# EAGLE design untitled (EAGLE 9.6.2)
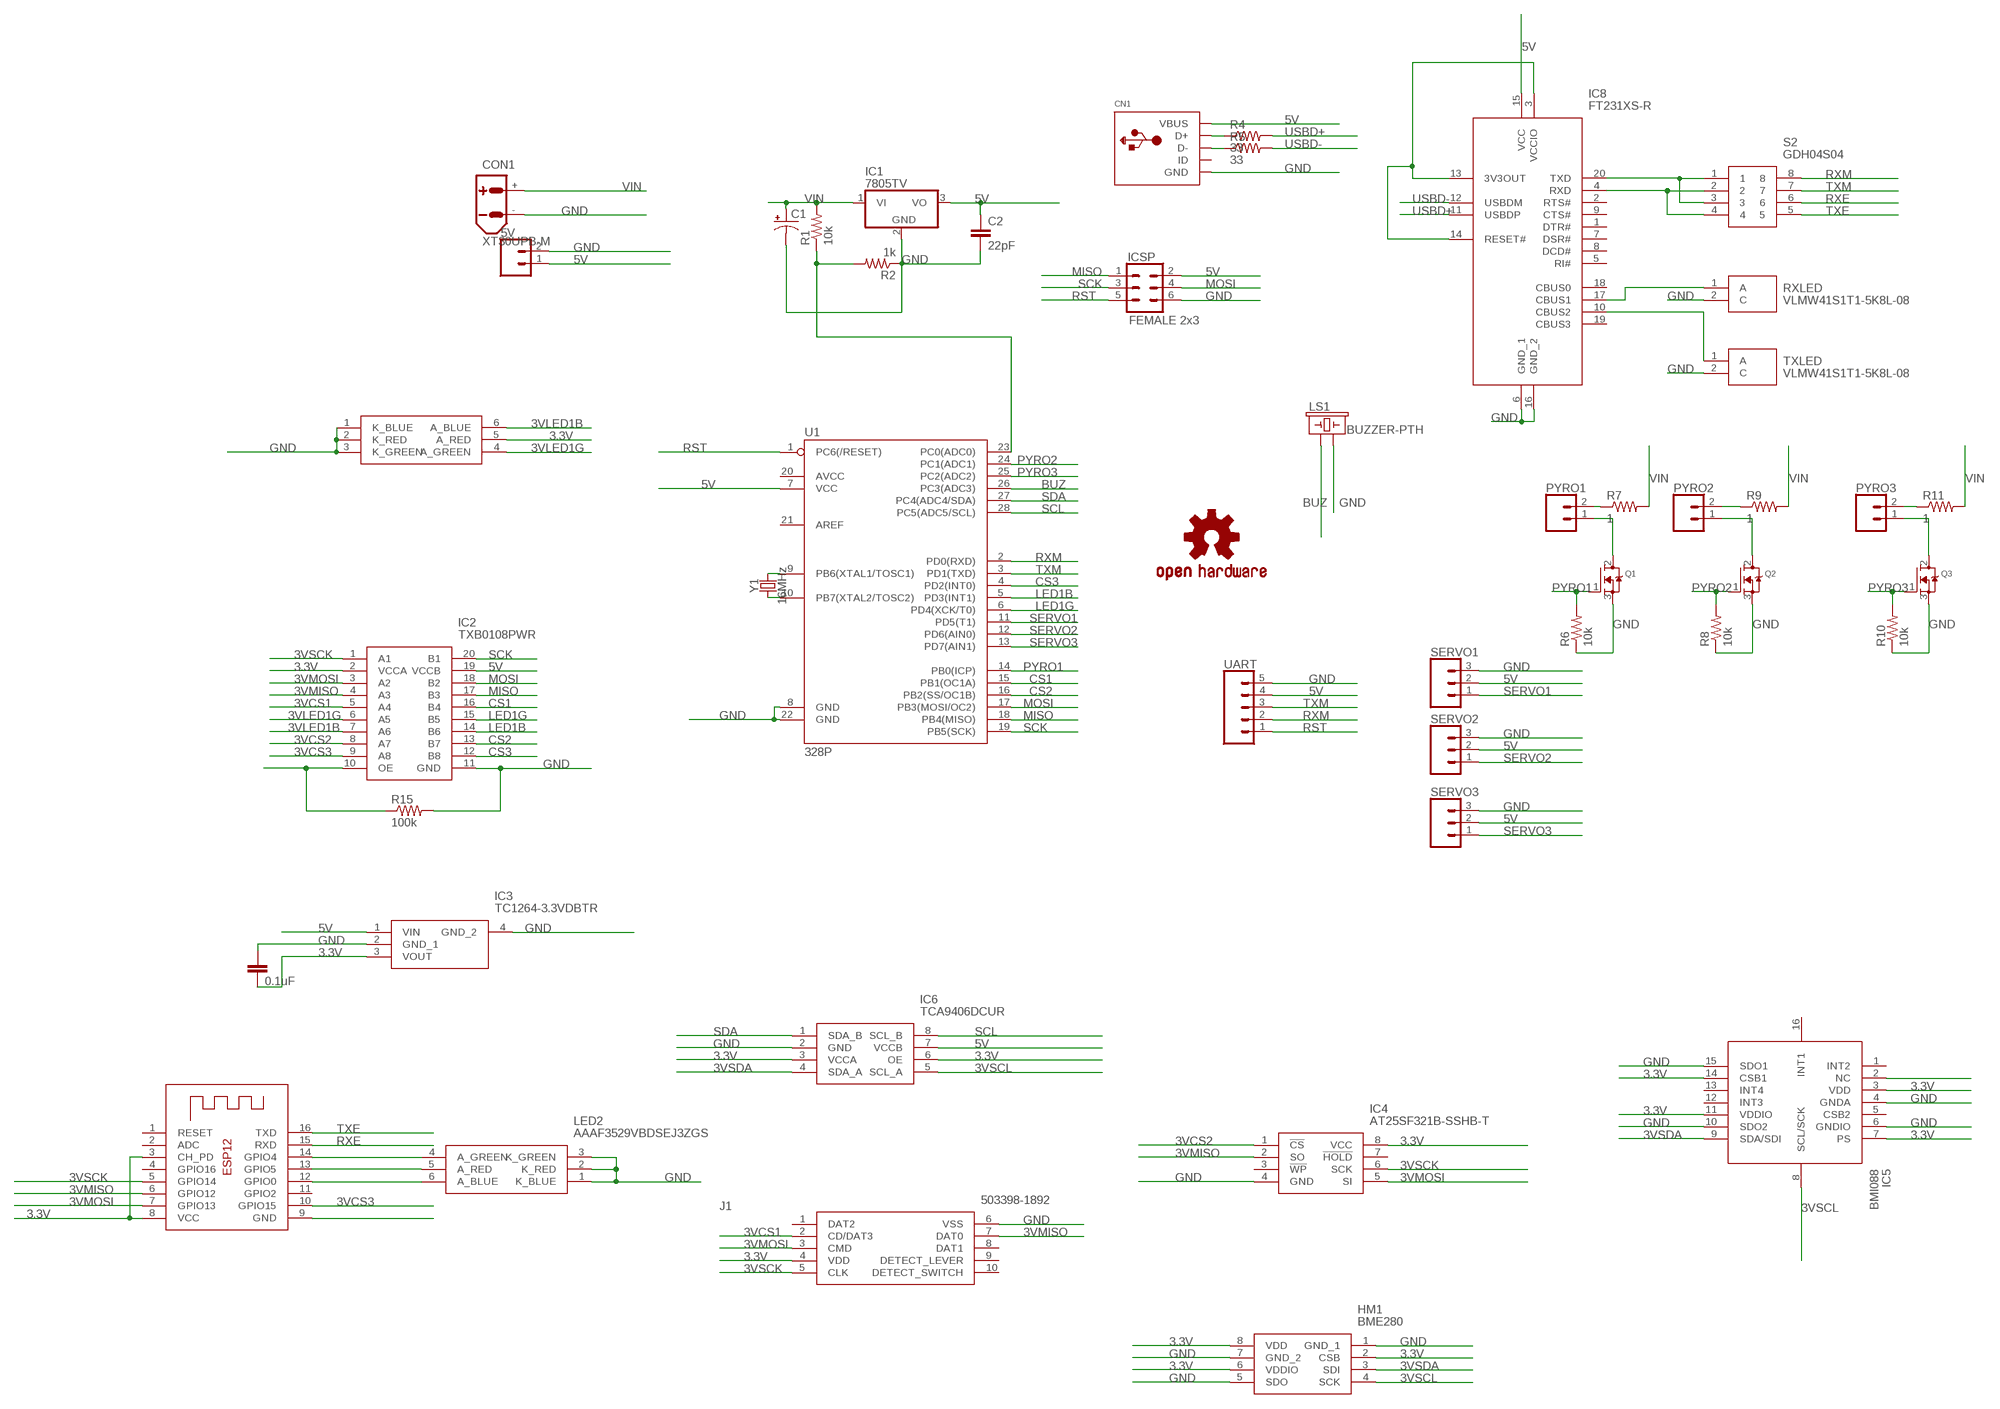
[diagram p0: schematic, sheet 1]

## Parts
5V  CONN_02  [1X02]
C1  CPOL-USE3.5-8  [E3,5-8]
C2  22pF  22PF-PTH-2.54MM-200V-5%  [CAP-PTH-2.54]
C4  0.1uF  0.1UF-KIT-EZ-50V-20%  [CAP-PTH-SMALL-KIT]
CN1  USBMINIB  [USB-MINIB]
CON1  XT30UPB-M  [XT30UPB-M]
HM1  BME280  [BME280]
IC1  7805TV  [TO220V]
IC2  TXB0108PWR  [SOP65P640X120-20N]
IC3  TC1264-3.3VDBTR  [SOT230P700X180-4N]
IC4  AT25SF321B-SSHB-T  [SOIC127P600X175-8N]
IC5  BMI088  [BMI088]
IC6  TCA9406DCUR  [SOP50P310X90-8N]
IC8  FT231XS-R  [SOP64P599X175-20N]
ICSP  FEMALE 2x3  CONN_03X2FEMALE  [2X3]
J1  503398-1892  [503398-1892]
LED1  AAAF3529VBDSEJ3ZGS  [AAAF3529VBDSEJ3ZGS]
LED2  AAAF3529VBDSEJ3ZGS  [AAAF3529VBDSEJ3ZGS]
LOGO1  OSHW-LOGOL  [OSHW-LOGO-L]
LS1  BUZZER-PTH  [BUZZER-12MM]
PYRO1  CONN_025MM  [SCREWTERMINAL-5MM-2]
PYRO2  CONN_025MM  [SCREWTERMINAL-5MM-2]
PYRO3  CONN_025MM  [SCREWTERMINAL-5MM-2]
Q1  MOSFET-NGDS_TO220V  [TO220V]
Q2  MOSFET-NGDS_TO220V  [TO220V]
Q3  MOSFET-NGDS_TO220V  [TO220V]
R1  10k  FLIPFLOP-RES  [0805-THM]
R2  1k  FLIPFLOP-RES  [0805-THM]
R4  33  FLIPFLOP-RES  [0805-THM]
R5  33  FLIPFLOP-RES  [0805-THM]
R6  10k  FLIPFLOP-RES  [0805-THM]
R7  1  FLIPFLOP-RES  [0805-THM]
R8  10k  FLIPFLOP-RES  [0805-THM]
R9  1  FLIPFLOP-RES  [0805-THM]
R10  10k  FLIPFLOP-RES  [0805-THM]
R11  1  FLIPFLOP-RES  [0805-THM]
R15  100k  FLIPFLOP-RES  [0805-THM]
RXLED  VLMW41S1T1-5K8L-08  [LEDM3528X185N]
S2  GDH04S04  [SOIC127P813X256-8N]
SERVO1  CONN_03  [1X03]
SERVO2  CONN_03  [1X03]
SERVO3  CONN_03  [1X03]
TXLED  VLMW41S1T1-5K8L-08  [LEDM3528X185N]
U1  328P  ATMEGA328P_PDIP  [DIP28]
UART  CONN_05  [1X05]
X1  ESP-12  [ESP-12]
Y1  16MHz  CRYSTAL-16MHZPTH-HC49US  [HC49US]

## Nets
3.3V: C4.2 HM1.2(CSB) HM1.6(VDDIO) HM1.8(VDD) IC2.2(VCCA) IC3.3(VOUT) IC4.8(VCC) IC5.3(VDD) IC5.7(PS) IC5.11(VDDIO) IC5.14(CSB1) IC6.3(VCCA) IC6.6(OE) J1.4(VDD) LED1.5(A_RED) X1.3(CH_PD) X1.8(VCC)
3VCS1: IC2.5(A4) J1.2(CD/DAT3)
3VCS2: IC2.8(A7) IC4.1(!CS)
3VCS3: IC2.9(A8) X1.10(GPIO15)
3VLED1B: IC2.7(A6) LED1.6(A_BLUE)
3VLED1G: IC2.6(A5) LED1.4(A_GREEN)
3VMISO: IC2.4(A3) IC4.2(SO) J1.7(DAT0) X1.6(GPIO12)
3VMOSI: IC2.3(A2) IC4.5(SI) J1.3(CMD) X1.7(GPIO13)
3VSCK: IC2.1(A1) IC4.6(SCK) J1.5(CLK) X1.5(GPIO14)
3VSCL: HM1.4(SCK) IC5.8(SCL/SCK) IC6.5(SCL_A)
3VSDA: HM1.3(SDI) IC5.9(SDA/SDI) IC6.4(SDA_A)
5V: 5V.1 C2.1 CN1.VBUS IC1.3(VO) IC2.19(VCCB) IC3.1(VIN) IC6.7(VCCB) IC8.15(VCC) ICSP.2 SERVO1.2 SERVO2.2 SERVO3.2 U1.7(VCC) UART.4
BUZ: LS1.+ U1.26(PC3(ADC3))
CS1: IC2.16(B4) U1.15(PB1(OC1A))
CS2: IC2.13(B7) U1.16(PB2(SS/OC1B))
CS3: IC2.12(B8) U1.4(PD2(INT0))
GND: 5V.2 C1.- C2.2 C4.1 CN1.GND CON1.- HM1.1(GND_1) HM1.5(SDO) HM1.7(GND_2) IC1.2(GND) IC2.11(GND) IC3.2(GND_1) IC3.4(GND_2) IC4.4(GND) IC5.4(GNDA) IC5.6(GNDIO) IC5.10(SDO2) IC5.15(SDO1) IC6.2(GND) IC8.6(GND_1) IC8.16(GND_2) ICSP.6 J1.6(VSS) LED1.1(K_BLUE) LED1.2(K_RED) LED1.3(K_GREEN) LED2.1(K_BLUE) LED2.2(K_RED) LED2.3(K_GREEN) LS1.- Q1.3(S) Q2.3(S) Q3.3(S) R2.1 R6.1 R8.1 R10.1 R15.2 RXLED.2(C) SERVO1.3 SERVO2.3 SERVO3.3 TXLED.2(C) U1.8(GND) U1.22(GND) UART.5 X1.9(GND)
LED1B: IC2.14(B6) U1.5(PD3(INT1))
LED1G: IC2.15(B5) U1.6(PD4(XCK/T0))
MISO: IC2.17(B3) ICSP.1 U1.18(PB4(MISO))
MOSI: IC2.18(B2) ICSP.4 U1.17(PB3(MOSI/OC2))
N$1: U1.9(PB6(XTAL1/TOSC1)) Y1.2
N$2: U1.10(PB7(XTAL2/TOSC2)) Y1.1
N$3: R1.1 R2.2 U1.23(PC0(ADC0))
N$4: CN1.D+ R4.1
N$5: IC8.17(CBUS1) RXLED.1(A)
N$6: IC8.20(TXD) S2.1 S2.3
N$7: IC8.4(RXD) S2.2 S2.4
N$8: IC8.3(VCCIO) IC8.13(3V3OUT) IC8.14(RESET#)
N$10: CN1.D- R5.1
N$11: IC8.10(CBUS2) TXLED.1(A)
N$12: LED2.4(A_GREEN) X1.14(GPIO4)
N$13: LED2.5(A_RED) X1.13(GPIO5)
N$14: IC2.10(OE) R15.1
N$15: PYRO1.1 Q1.2(D)
N$16: PYRO1.2 R7.1
N$17: PYRO2.1 Q2.2(D)
N$18: PYRO2.2 R9.1
N$19: PYRO3.1 Q3.2(D)
N$20: PYRO3.2 R11.1
N$21: LED2.6(A_BLUE) X1.12(GPIO0)
N$24: IC5.2(NC)
PYRO1: Q1.1(G) R6.2 U1.14(PB0(ICP))
PYRO2: Q2.1(G) R8.2 U1.24(PC1(ADC1))
PYRO3: Q3.1(G) R10.2 U1.25(PC2(ADC2))
RST: ICSP.5 U1.1(PC6(/RESET)) UART.1
RXE: S2.6 X1.15(RXD)
RXM: S2.8 U1.2(PD0(RXD)) UART.2
SCK: IC2.20(B1) ICSP.3 U1.19(PB5(SCK))
SCL: IC6.8(SCL_B) U1.28(PC5(ADC5/SCL))
SDA: IC6.1(SDA_B) U1.27(PC4(ADC4/SDA))
SERVO1: SERVO1.1 U1.11(PD5(T1))
SERVO2: SERVO2.1 U1.12(PD6(AIN0))
SERVO3: SERVO3.1 U1.13(PD7(AIN1))
TXE: S2.5 X1.16(TXD)
TXM: S2.7 U1.3(PD1(TXD)) UART.3
USBD+: IC8.11(USBDP) R4.2
USBD-: IC8.12(USBDM) R5.2
VIN: C1.+ CON1.+ IC1.1(VI) R1.2 R7.2 R9.2 R11.2
Unconnected: CN1.ID IC4.3(!WP) IC4.7(!HOLD) IC5.1(INT2) IC5.5(CSB2) IC5.12(INT3) IC5.13(INT4) IC5.16(INT1) IC8.1(DTR#) IC8.2(RTS#) IC8.5(RI#) IC8.7(DSR#) IC8.8(DCD#) IC8.9(CTS#) IC8.18(CBUS0) IC8.19(CBUS3) J1.1(DAT2) J1.8(DAT1) J1.9(DETECT_LEVER) J1.10(DETECT_SWITCH) U1.20(AVCC) U1.21(AREF) X1.1(RESET) X1.2(ADC) X1.4(GPIO16) X1.11(GPIO2)

## Library data of the parts
5V = SparkFun-Connectors:CONN_02: Multi connection point. Often used as Generic Header-pin footprint for 0.1 inch spaced/style header connections On any of the 0.1 inch spaced packages, you can populate with these: Break Away Headers - Straight <https://www.sparkfun.com/products/116> (PRT-00116) Break Away Male Headers - Right Angle <https://www.sparkfun.com/products/553> (PRT-00553) Female Headers <https://www.sparkfun.com/products/115> (PRT-00115) Break Away Headers - Machine Pin <https://www.sparkfun.com/products/117> (PRT-00117) Break Away Female Headers - Swiss Machine Pin <https://www.sparkfun.com/products/743> (PRT-00743) For SCREWTERMINALS and SPRING TERMINALS visit here: Screw Terimnals on SparkFun.com <https://www.sparkfun.com/search/results?term=Screw+Terminals> (5mm/3.5mm/2.54mm spacing) This device is also useful as a general connection point to wire up your design to another part of your project. Our various solder wires solder well into these plated through hole pads. Hook-Up Wire - Assortment (Stranded, 22 AWG) <https://www.sparkfun.com/products/11375> (PRT-11375) Hook-Up Wire - Assortment (Solid Core, 22 AWG) <https://www.sparkfun.com/products/11367> (PRT-11367) View the entire wire category on our website here <https://www.sparkfun.com/categories/141> Special notes: Molex polarized connector foot print use with: PRT-08233 with associated crimp pins and housings. 2.54_SCREWTERM for use with PRT-10571. 3.5mm Screw Terminal footprints for PRT-08084 5mm Screw Terminal footprints for use with PRT-08432
C1 = rcl:CPOL-US: POLARIZED CAPACITOR, American symbol; SPICEPREFIX: C
C2 = SparkFun-Capacitors:22PF: 22pF ceramic capacitors A capacitor is a passive two-terminal electrical component used to store electrical energy temporarily in an electric field.; PROD_ID: CAP-09128
C4 = SparkFun-Capacitors:0.1UF: 0.1µF ceramic capacitors A capacitor is a passive two-terminal electrical component used to store electrical energy temporarily in an electric field.; PROD_ID: CAP-08370
CN1 = adafruit:USB: USB Connectors USBMINIB - Surface Mount Female Mini-B USB Connector 4UConnector: 06564 By microbuilder.eu Thru-hole RA Female Mini-B USB Connector 4UConnector: 18732 By ladyada.net
CON1 = amass:XT30: AMASS XT30 connector Store in Japan AMASS XT30 connector <https://szc.jp/ams-xt30>
HM1 = BME280:BME280: Board Mount Humidity Sensors Source: Datasheet <https://datasheet.datasheetarchive.com/originals/distributors/DKDS-24/462906.pdf>; DESCRIPTION: Board Mount Humidity Sensors; HEIGHT: mm; MANUFACTURER_NAME: BOSCH; MANUFACTURER_PART_NUMBER: BME280; MOUSER_PART_NUMBER: 262-BME280; MOUSER_PRICE-STOCK: https://www.mouser.co.uk/ProductDetail/Bosch-Sensortec/BME280?qs=2OnyuXx6vpj2fK9HX7qb3g%3D%3D
IC1 = linear:78*: Positive VOLTAGE REGULATOR Source: http://cache.national.com/ds/LM/LM78L05.pdf http://www.fairchildsemi.com/ds/LM/LM7805.pdf
IC2 = TXB0108PWR:TXB0108PWR: 8-Bit Bidirectional Voltage-Level Shifter with Auto Direction Sensing and +/-15-kV ESD Protect Source: Datasheet <http://www.ti.com/lit/ds/symlink/txb0108.pdf>; DESCRIPTION: 8-Bit Bidirectional Voltage-Level Shifter with Auto Direction Sensing and +/-15-kV ESD Protect; HEIGHT: 1.2mm; MANUFACTURER_NAME: Texas Instruments; MANUFACTURER_PART_NUMBER: TXB0108PWR; MOUSER_PART_NUMBER: 595-TXB0108PWR; MOUSER_PRICE-STOCK: https://www.mouser.co.uk/ProductDetail/Texas-Instruments/TXB0108PWR?qs=oFXvjAmG9EgEUWGWzOVFCA%3D%3D
IC3 = TC1264-3.3VDBTR:TC1264-3.3VDBTR: LDO Voltage Regulators 800mA Fixed Output Source: Datasheet; DESCRIPTION: LDO Voltage Regulators 800mA Fixed Output; HEIGHT: 1.8mm; MANUFACTURER_NAME: Microchip; MANUFACTURER_PART_NUMBER: TC1264-3.3VDBTR; MOUSER_PART_NUMBER: 579-TC1264-3.3VDBTR; MOUSER_PRICE-STOCK: https://www.mouser.co.uk/ProductDetail/Microchip-Technology-Atmel/TC1264-3.3VDBTR?qs=EkZBwCRGcSs72PT5fOeaFg%3D%3D
IC4 = AT25SF321B-SSHB-T:AT25SF321B-SSHB-T: NOR Flash 32 Mbit, 3.0V (2.7V to 3.6V), -40C to 85C, SOIC-N 150mil (Tape & Reel), Single, Dual, Quad SPI NOR flash Source: Datasheet <https://www.mouser.fr/datasheet/2/698/adet_s_a0010543939_1-2956529.pdf>; DESCRIPTION: NOR Flash 32 Mbit, 3.0V (2.7V to 3.6V), -40C to 85C, SOIC-N 150mil (Tape & Reel), Single, Dual, Quad SPI NOR flash; HEIGHT: 1.75mm; MANUFACTURER_NAME: Dialog Semiconductor; MANUFACTURER_PART_NUMBER: AT25SF321B-SSHB-T; MOUSER_PART_NUMBER: 988-AT25SF321BSSHB-T; MOUSER_PRICE-STOCK: https://www.mouser.co.uk/ProductDetail/Dialog-Semiconductor/AT25SF321B-SSHB-T?qs=IS%252B4QmGtzzpJt7diTvTTCw%3D%3D
IC5 = BMI088:BMI088: Inertial Measurement Unit Digital Output 2.5V/3.3V Automotive Source: Datasheet <https://datasheet.datasheetarchive.com/originals/distributors/Datasheets_SAMA/994c3bf88e91a9e9fead6a819d348e4d.pdf>; DESCRIPTION: Inertial Measurement Unit Digital Output 2.5V/3.3V Automotive; HEIGHT: 1.45mm; MANUFACTURER_NAME: BOSCH; MANUFACTURER_PART_NUMBER: BMI088; MOUSER_PART_NUMBER: 262-BMI088; MOUSER_PRICE-STOCK: https://www.mouser.co.uk/ProductDetail/Bosch-Sensortec/BMI088?qs=f9yNj16SXrIMFspTV6RB6Q%3D%3D
IC6 = TCA9406DCUR:TCA9406DCUR: 2-Bit Bidirectional 1-MHz I2C Bus and SMBus Voltage-Level Shifter Source: Datasheet <http://www.ti.com/lit/ds/symlink/tca9406.pdf>; DESCRIPTION: 2-Bit Bidirectional 1-MHz I2C Bus and SMBus Voltage-Level Shifter; HEIGHT: 0.9mm; MANUFACTURER_NAME: Texas Instruments; MANUFACTURER_PART_NUMBER: TCA9406DCUR; MOUSER_PART_NUMBER: 595-TCA9406DCUR; MOUSER_PRICE-STOCK: https://www.mouser.co.uk/ProductDetail/Texas-Instruments/TCA9406DCUR?qs=Ze4%2FuFuz19JoG7CJtrwdKQ%3D%3D
IC8 = FT231XS-R:FT231XS-R: FTDI Chip FT231XS-R, Interface RS232, RS422, RS485, SIE, UART 3MBd, 5 V, 20-pin, SSOP Source: Datasheet <https://datasheet.datasheetarchive.com/originals/distributors/Datasheets_SAMA/824938d1687833d6997706543241551a.pdf>; DESCRIPTION: FTDI Chip FT231XS-R, Interface RS232, RS422, RS485, SIE, UART 3MBd, 5 V, 20-pin, SSOP; HEIGHT: 1.753mm; MANUFACTURER_NAME: FTDI Chip; MANUFACTURER_PART_NUMBER: FT231XS-R; MOUSER_PART_NUMBER: 895-FT231XS-R; MOUSER_PRICE-STOCK: https://www.mouser.co.uk/ProductDetail/FTDI/FT231XS-R?qs=Gp1Yz1mis3WduRPsgrTbtg%3D%3D
ICSP = SparkFun-Connectors:CONN_03X2: Multi connection point. Often used as Generic Header-pin footprint for 0.1 inch spaced/style header connections You can populate with any combo of single row headers, but if you'd like an exact match, check these: Header - 2x3 (Male, 0.1") <https://www.sparkfun.com/products/12807> (PRT-12807) Header - 2x3 (Female, 0.1") <https://www.sparkfun.com/products/13010> (PRT-13010) 2x3 Pin Shrouded Header <https://www.sparkfun.com/products/10877> (PRT-10877) On any of the 0.1 inch spaced packages, you can populate with these: Break Away Headers - Straight <https://www.sparkfun.com/products/116> (PRT-00116) Break Away Male Headers - Right Angle <https://www.sparkfun.com/products/553> (PRT-00553) Female Headers <https://www.sparkfun.com/products/115> (PRT-00115) Break Away Headers - Machine Pin <https://www.sparkfun.com/products/117> (PRT-00117) Break Away Female Headers - Swiss Machine Pin <https://www.sparkfun.com/products/743> (PRT-00743) Special note: the shrouded connector mates well with our 3x2 ribbon cables: Ribbon Crimp Connector - 6-pin (2x3, Female) <https://www.sparkfun.com/products/10651> (PRT-10651) Ribbon Cable - 6 wire (15ft) <https://www.sparkfun.com/products/10646> (PRT-10646); PROD_ID: CONN-11566
J1 = 503398-1892:503398-1892: MicroSD SMT Push-Push 1.28mm height MicroSD SMT Push-Push 1.28mm height Source: Datasheet <http://www.molex.com/webdocs/datasheets/pdf/en-us//5033981892_MEMORY_CARD_SOCKET.pdf>; DESCRIPTION: MicroSD SMT Push-Push 1.28mm height MicroSD SMT Push-Push 1.28mm height; HEIGHT: mm; MANUFACTURER_NAME: Molex; MANUFACTURER_PART_NUMBER: 503398-1892; MOUSER_PART_NUMBER: 538-503398-1892; MOUSER_PRICE-STOCK: https://www.mouser.co.uk/ProductDetail/Molex/503398-1892?qs=b0v8CoHHvSMxV%252BW12iKaSg%3D%3D
LED1 LED2 = AAAF3529VBDSEJ3ZGS:AAAF3529VBDSEJ3ZGS: Standard LEDs - SMD 3.5X2.8MM RGB SMD LED Source: Datasheet <https://componentsearchengine.com/Datasheets/1/AAAF3529VBDSEJ3ZGS.pdf>; DESCRIPTION: Standard LEDs - SMD 3.5X2.8MM RGB SMD LED; HEIGHT: 1.85mm; MANUFACTURER_NAME: Kingbright; MANUFACTURER_PART_NUMBER: AAAF3529VBDSEJ3ZGS; MOUSER_PART_NUMBER: 604-AAAF3529VBDSEJ3Z; MOUSER_PRICE-STOCK: https://www.mouser.com/Search/Refine.aspx?Keyword=604-AAAF3529VBDSEJ3Z
LOGO1 = SparkFun-Aesthetics:OSHW-LOGO: Open-Source Hardware (OSHW) Logo This logo indicates the piece of hardware it is found on incorporates a OSHW license and/or adheres to the definition of open source hardware found here: http://freedomdefined.org/OSHW
LS1 = SparkFun-Electromechanical:BUZZER: Buzzer Small round buzzers that operate around the audible 2kHz range. You can use these as speakers to create simple music or user interfaces. Variant Overview: PTH - Mini Speaker - PC Mount 12mm 2.048kHz <https://www.sparkfun.com/products/7950> PTH_KIT - Mini Speaker - PC Mount 12mm 2.048kHz <https://www.sparkfun.com/products/7950> KIT simplifies soldering by adding stop mask to one side of the pads. PTH_NO_SILK - Mini Speaker - PC Mount 12mm 2.048kHz <https://www.sparkfun.com/products/7950> No silkscreen indicator of buzzer outline. PTH_KIT_NO_SILK - Mini Speaker - PC Mount 12mm 2.048kHz <https://www.sparkfun.com/products/7950> KIT package w/o silkscreen SMD - Buzzer Audio Magnetic (CCV-084B16) SMD buzzer used on, e.g. the LilyPad Buzzer <https://www.sparkfun.com/products/8463> and RFID USB Reader <https://www.sparkfun.com/products/9963>. SMD_KIT - Buzzer Audio Magnetic (CCV-084B16) SMD Buzzer with elongated pins to make soldering easier. Used on the SparkFun Simon Says - Surface Mount Soldering Kit <https://www.sparkfun.com/products/10935>.; PROD_ID: COMP-08253; SF_SKU: COM-07950
PYRO1-PYRO3 = SparkFun-Connectors:CONN_02: Multi connection point. Often used as Generic Header-pin footprint for 0.1 inch spaced/style header connections On any of the 0.1 inch spaced packages, you can populate with these: Break Away Headers - Straight <https://www.sparkfun.com/products/116> (PRT-00116) Break Away Male Headers - Right Angle <https://www.sparkfun.com/products/553> (PRT-00553) Female Headers <https://www.sparkfun.com/products/115> (PRT-00115) Break Away Headers - Machine Pin <https://www.sparkfun.com/products/117> (PRT-00117) Break Away Female Headers - Swiss Machine Pin <https://www.sparkfun.com/products/743> (PRT-00743) For SCREWTERMINALS and SPRING TERMINALS visit here: Screw Terimnals on SparkFun.com <https://www.sparkfun.com/search/results?term=Screw+Terminals> (5mm/3.5mm/2.54mm spacing) This device is also useful as a general connection point to wire up your design to another part of your project. Our various solder wires solder well into these plated through hole pads. Hook-Up Wire - Assortment (Stranded, 22 AWG) <https://www.sparkfun.com/products/11375> (PRT-11375) Hook-Up Wire - Assortment (Solid Core, 22 AWG) <https://www.sparkfun.com/products/11367> (PRT-11367) View the entire wire category on our website here <https://www.sparkfun.com/categories/141> Special notes: Molex polarized connector foot print use with: PRT-08233 with associated crimp pins and housings. 2.54_SCREWTERM for use with PRT-10571. 3.5mm Screw Terminal footprints for PRT-08084 5mm Screw Terminal footprints for use with PRT-08432; SF_SKU: PRT-08432
Q1-Q3 = adafruit:MOSFET-N: N-Channel Mosfet 2N7002E - 60V 260mA SOT23 [Digikey: 2N7002ET1GOSTR-ND] - REEL BSH103 - 30V 850mA SOT23 [Digikey: 568-5013-1-ND]
R1 R2 R4-R11 R15 = adafruit:FLIPFLOP-RES: Flip Flop resistor An 0805 resistor inside a standard 1/4W 5% resistor. Makes for easy mods
RXLED TXLED = VLMW41S1T1-5K8L-08:VLMW41S1T1-5K8L-08: LED Uni-Color White PLCC Vishay VLMW41 Series White LED 5500K, 355 mcd 120 Source: Datasheet <http://www.vishay.com/docs/81370/vlmw41.pdf>; DESCRIPTION: LED Uni-Color White PLCC Vishay VLMW41 Series White LED 5500K, 355 mcd 120; HEIGHT: 1.85mm; MANUFACTURER_NAME: Vishay; MANUFACTURER_PART_NUMBER: VLMW41S1T1-5K8L-08; MOUSER_PART_NUMBER: 78-VLMW41S1T1; MOUSER_PRICE-STOCK: https://www.mouser.co.uk/ProductDetail/Vishay-Semiconductors/VLMW41S1T1-5K8L-08?qs=F8HfwHd0zjcupQzkt4CRIQ%3D%3D
S2 = GDH04S04:GDH04S04: 4way half pitch surface mount DIL switch 4 Way Surface Mount DIP Switch 4P Source: Datasheet <http://www.te.com/commerce/DocumentDelivery/DDEController?Action=showdoc&DocId=Customer Drawing1571983C6pdfEnglishENG_CD_1571983_C6.pdf1571983-4>; DESCRIPTION: 4way half pitch surface mount DIL switch 4 Way Surface Mount DIP Switch 4P; HEIGHT: 2.56mm; MANUFACTURER_NAME: TE Connectivity; MANUFACTURER_PART_NUMBER: GDH04S04; MOUSER_PART_NUMBER: 506-GDH04S04; MOUSER_PRICE-STOCK: https://www.mouser.co.uk/ProductDetail/TE-Connectivity-Alcoswitch/GDH04S04?qs=wg6chLqwgwrFTPnUQOwjIg%3D%3D
SERVO1-SERVO3 = SparkFun-Connectors:CONN_03: Multi connection point. Often used as Generic Header-pin footprint for 0.1 inch spaced/style header connections On any of the 0.1 inch spaced packages, you can populate with these: Break Away Headers - Straight <https://www.sparkfun.com/products/116> (PRT-00116) Break Away Male Headers - Right Angle <https://www.sparkfun.com/products/553> (PRT-00553) Female Headers <https://www.sparkfun.com/products/115> (PRT-00115) Break Away Headers - Machine Pin <https://www.sparkfun.com/products/117> (PRT-00117) Break Away Female Headers - Swiss Machine Pin <https://www.sparkfun.com/products/743> (PRT-00743) Stackable Header - 3 Pin (Female, 0.1") <https://www.sparkfun.com/products/13875> (PRT-13875) For SCREWTERMINALS and SPRING TERMINALS visit here: Screw Terimnals on SparkFun.com <https://www.sparkfun.com/search/results?term=Screw+Terminals> (5mm/3.5mm/2.54mm spacing) This device is also useful as a general connection point to wire up your design to another part of your project. Our various solder wires solder well into these plated through hole pads. Hook-Up Wire - Assortment (Stranded, 22 AWG) <https://www.sparkfun.com/products/11375> (PRT-11375) Hook-Up Wire - Assortment (Solid Core, 22 AWG) <https://www.sparkfun.com/products/11367> (PRT-11367) View the entire wire category on our website here <https://www.sparkfun.com/categories/141> Special notes: Molex polarized connector foot print use with SKU : PRT-08232 with associated crimp pins and housings.
U1 = SparkFun-IC-Microcontroller:ATMEGA328P_PDIP: Atmel 328P Through hole ATMEGA328P uC used in the Arduino 32kb flash, 1k EEPROM, 2k SRAM Datasheet <http://www.sparkfun.com/datasheets/Components/SMD/ATMega328.pdf> SparkFun Products Storefront component: AVR 28 Pin 20MHz 32K 6A/D - ATMega328P <https://www.sparkfun.com/products/9061> (COM-09061) SparkFun Simon Says - Through-Hole Soldering Kit <https://www.sparkfun.com/products/10547> (KIT-10547) SparkFun Learn to Solder - Simon Says <https://www.sparkfun.com/products/13708> (KIT-13708) SparkFun BigTime Watch Kit <https://www.sparkfun.com/products/11734> (KIT-11734) SparkFun ClockIt <https://www.sparkfun.com/products/10930> (KIT-10930) SparkFun Serial Enabled LCD Kit <https://www.sparkfun.com/products/10097> (LCD-10097) SparkFun Simon Tilts - Through Hole Soldering Kit <https://www.sparkfun.com/products/12634> (KIT-12634) SparkFun Frequency Counter Kit <https://www.sparkfun.com/products/10140> (KIT-10140) FabFM Radio Kit <https://www.sparkfun.com/products/11043> (KIT-11043) SparkFun Binary Blaster Kit <https://www.sparkfun.com/products/12037> (KIT-12037) SparkFun Metro-Gnome <https://www.sparkfun.com/products/9236> (KIT-09236) ATmega328 with Arduino Optiboot (Uno) <https://www.sparkfun.com/products/10524> (DEV-10524); PROD_ID: IC-09136
UART = SparkFun-Connectors:CONN_05: Multi connection point. Often used as Generic Header-pin footprint for 0.1 inch spaced/style header connections On any of the 0.1 inch spaced packages, you can populate with these: Break Away Headers - Straight <https://www.sparkfun.com/products/116> (PRT-00116) Break Away Male Headers - Right Angle <https://www.sparkfun.com/products/553> (PRT-00553) Female Headers <https://www.sparkfun.com/products/115> (PRT-00115) Break Away Headers - Machine Pin <https://www.sparkfun.com/products/117> (PRT-00117) Break Away Female Headers - Swiss Machine Pin <https://www.sparkfun.com/products/743> (PRT-00743) For SCREWTERMINALS and SPRING TERMINALS visit here: Screw Terimnals on SparkFun.com <https://www.sparkfun.com/search/results?term=Screw+Terminals> (5mm/3.5mm/2.54mm spacing) This device is also useful as a general connection point to wire up your design to another part of your project. Our various solder wires solder well into these plated through hole pads. Hook-Up Wire - Assortment (Stranded, 22 AWG) <https://www.sparkfun.com/products/11375> (PRT-11375) Hook-Up Wire - Assortment (Solid Core, 22 AWG) <https://www.sparkfun.com/products/11367> (PRT-11367) View the entire wire category on our website here <https://www.sparkfun.com/categories/141> Special notes: Molex polarized connector foot print use with SKU : PRT-08231 with associated crimp pins and housings. 1MM SMD Version SKU: PRT-10208
X1 = adafruit:ESP-12
Y1 = SparkFun-Clocks:CRYSTAL-16MHZ: 16MHz Crystal Digikey Example <http://www.digikey.com/product-search/en?keywords=535-9122-1-ND> Frequency: 16MHz Frequency Stability: ±50ppm Frequency Tolerance: ±20ppm Load Capacitance: 18pF SparkFun Products: Pro Micro -5V/16MHz <https://www.sparkfun.com/products/12640> SparkFun Serial Enabled LCD Kit <https://www.sparkfun.com/products/10097>; PROD_ID: XTAL-08181; SF_ID: COM-00536

## Net classes
0 default: width 0.1 mm, drill 0.15 mm

## Board
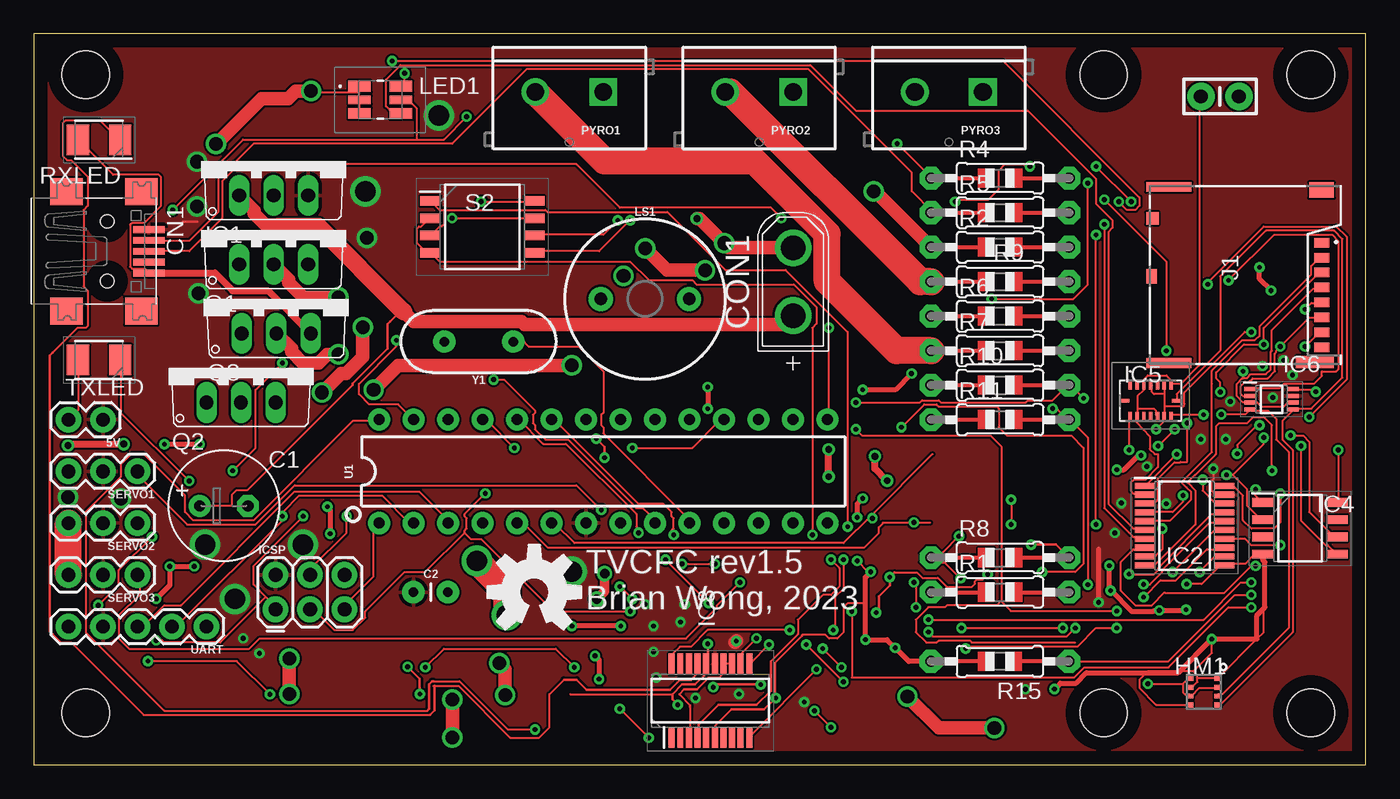
[diagram p1: board, top side]
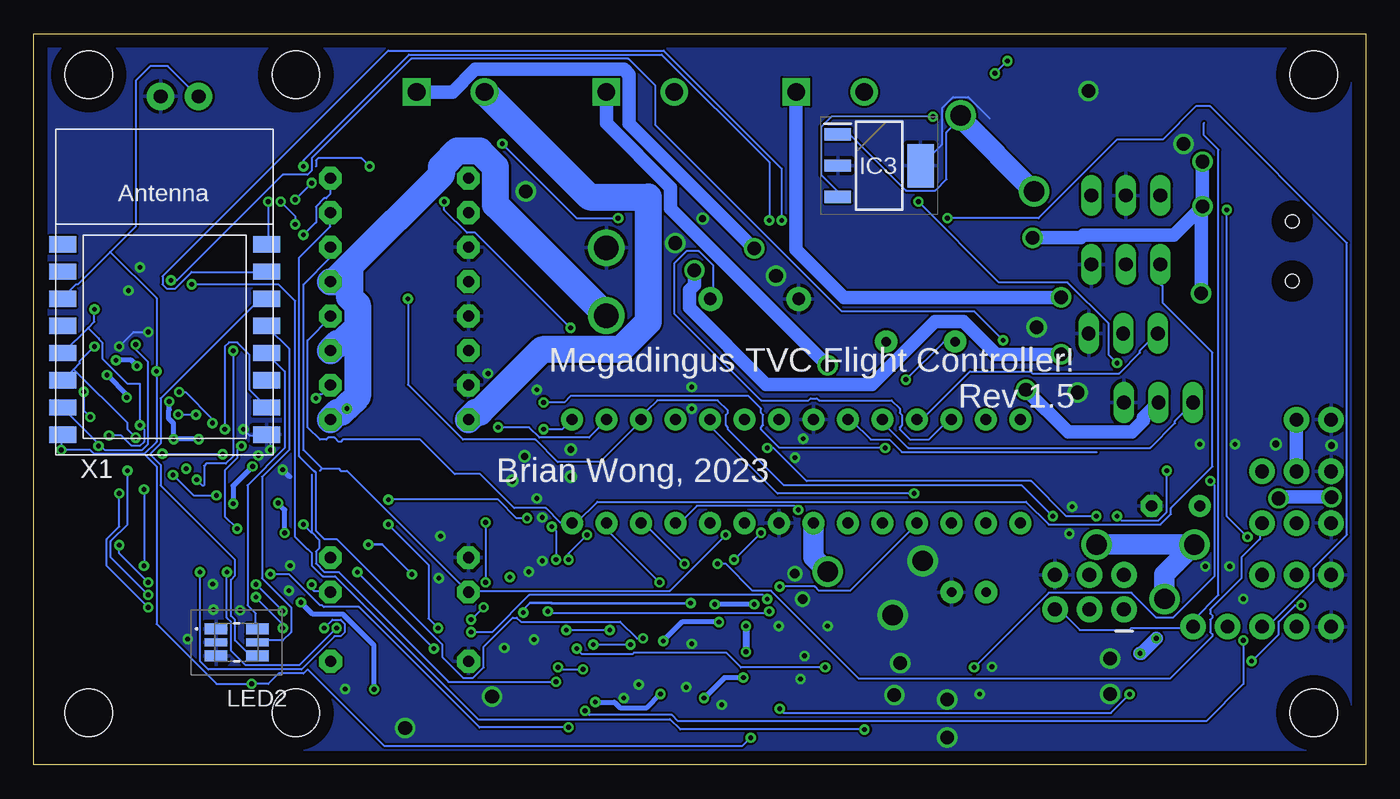
[diagram p2: board, bottom side, seen from below]

Size 98.02 x 53.8 mm. Coordinates in mm from the lower left corner, seen from the top.
Outline: 0,0 98.02,0 98.02,53.8 0,53.8 0,0
Copper layers (1*16): Top 0.035mm / dielectric 1.5mm / Bottom 0.035mm
Design rules "default *": minimum track width 6mil, minimum drill 0.35mm, track to track 6mil, track to pad 6mil, pad to pad 6mil, via to via 6mil, smd to smd 6mil, copper to edge 40mil, drill to drill 6mil, minimum pad ring 10mil, minimum via ring 8mil, stop-mask expansion 4mil, vias tented up to drill 0mil, thermal gap 10mil
Holes 3.5 mm at 3.81,3.81 78.74,3.81 3.81,50.8 78.74,50.8 93.98,3.81 93.98,50.8

### Footprints (pad centres in the part's own frame; a part is rotated, then mirrored left to right if it is on the bottom)
1X02 = drill 1.016 pad 1.88: 1 0,0; 2 2.54,0
E3,5-8 = drill 0.813 pad 1.6: + -1.778,0 | drill 0.813 pad 1.6 octagon: - 1.778,0
CAP-PTH-2.54 = drill 0.7 pad 1.651: 1 -1.27,0; 2 1.27,0
CAP-PTH-SMALL-KIT = drill 1.016 pad 2.032: 1 -1.397,0; 2 1.397,0
USB-MINIB = smd 0.5 x 2.308: D+ 0,4.064; D- -0.8,4.064; GND 1.6,4.064; ID 0.8,4.064; VBUS -1.6,4.064 | smd 2 x 2.4: GND1 -4.4,-2; GND2 -4.4,3.5; GND3 4.4,3.5; GND4 4.4,-2 | hole 1: -2.2,1; 2.2,1
XT30UPB-M = drill 1.8: + 2.5,0; - -2.5,0
BME280 = smd 0.5 x 0.35: 1 2.05,0; 2 2.05,-0.65; 3 2.05,-1.3; 4 2.05,-1.95; 5 0,-1.95; 6 0,-1.3; 7 0,-0.65; 8 0,0
TO220V = drill 1.016 long: 1 -2.54,-2.54; 2 0,-2.54; 3 2.54,-2.54
SOP65P640X120-20N = smd 1.475 x 0.45: 1 -2.938,2.925; 2 -2.938,2.275; 3 -2.938,1.625; 4 -2.938,0.975; 5 -2.938,0.325; 6 -2.938,-0.325; 7 -2.938,-0.975; 8 -2.938,-1.625; 9 -2.938,-2.275; 10 -2.938,-2.925; 11 2.938,-2.925; 12 2.938,-2.275; 13 2.938,-1.625; 14 2.938,-0.975; 15 2.938,-0.325; 16 2.938,0.325; 17 2.938,0.975; 18 2.938,1.625; 19 2.938,2.275; 20 2.938,2.925
SOT230P700X180-4N = smd 1.95 x 0.9: 1 -3.05,2.3; 2 -3.05,0; 3 -3.05,-2.3 | smd 1.95 x 3.2: 4 3.05,0
SOIC127P600X175-8N = smd 1.55 x 0.65: 1 -2.725,1.905; 2 -2.725,0.635; 3 -2.725,-0.635; 4 -2.725,-1.905; 5 2.725,-1.905; 6 2.725,-0.635; 7 2.725,0.635; 8 2.725,1.905
BMI088 = smd 0.25 x 0.675: 1 -1.5,1.165; 2 -1,1.165; 3 -0.5,1.165; 4 0,1.165; 5 0.5,1.165; 6 1,1.165; 7 1.5,1.165; 9 1.5,-1.165; 10 1,-1.165; 11 0.5,-1.165; 12 0,-1.165; 13 -0.5,-1.165; 14 -1,-1.165; 15 -1.5,-1.165 | smd 0.675 x 0.25: 8 1.915,0; 16 -1.915,0
SOP50P310X90-8N = smd 0.85 x 0.3: 1 -1.575,0.75; 2 -1.575,0.25; 3 -1.575,-0.25; 4 -1.575,-0.75; 5 1.575,-0.75; 6 1.575,-0.25; 7 1.575,0.25; 8 1.575,0.75
SOP64P599X175-20N = smd 1.526 x 0.435: 1 -2.712,2.858; 2 -2.712,2.222; 3 -2.712,1.588; 4 -2.712,0.952; 5 -2.712,0.318; 6 -2.712,-0.318; 7 -2.712,-0.952; 8 -2.712,-1.588; 9 -2.712,-2.222; 10 -2.712,-2.858; 11 2.712,-2.858; 12 2.712,-2.222; 13 2.712,-1.588; 14 2.712,-0.952; 15 2.712,-0.318; 16 2.712,0.318; 17 2.712,0.952; 18 2.712,1.588; 19 2.712,2.222; 20 2.712,2.858
2X3 = drill 1.016 pad 1.88: 1 0,0; 2 0,2.54; 3 2.54,0; 4 2.54,2.54; 5 5.08,0; 6 5.08,2.54
503398-1892 = smd 0.7 x 1.1: 1 4.17,-1.4; 2 5.27,-1.4; 3 6.37,-1.4; 4 7.47,-1.4; 5 8.57,-1.4; 6 9.67,-1.4; 7 10.77,-1.4; 8 11.87,-1.4 | smd 0.9 x 0.93: 9 2.38,-13.865 | smd 1.05 x 0.78: 10 6.645,-13.94 | smd 0.7 x 3.33: 11 13.03,-12.665; 14 0.07,-12.665 | smd 0.86 x 2.8: 12 12.95,-1.9 | smd 1.14 x 1.83: 13 0.29,-1.415
AAAF3529VBDSEJ3ZGS = smd 1.65 x 0.8: 1 1.525,-1; 3 1.525,1; 4 -1.525,1; 6 -1.525,-1 | smd 1.65 x 0.6: 2 1.525,0; 5 -1.525,0
BUZZER-12MM = drill 0.9 pad 1.778: + 3.25,0; - -3.25,0
SCREWTERMINAL-5MM-2 = drill 1.3 pad 2.032 square: 1 0,0 | drill 1.3 pad 2.032: 2 5,0
0805-THM = drill 0.813 pad 1.676 octagon: 1 -5.08,0; 2 5.08,0
LEDM3528X185N = smd 1.65 x 2.25: 1 -1.55,0; 2 1.55,0
SOIC127P813X256-8N = smd 1.475 x 0.7: 1 -3.838,1.905; 2 -3.838,0.635; 3 -3.838,-0.635; 4 -3.838,-1.905; 5 3.838,-1.905; 6 3.838,-0.635; 7 3.838,0.635; 8 3.838,1.905
1X03 = drill 1.016 pad 1.88: 1 0,0; 2 2.54,0; 3 5.08,0
DIP28 = drill 0.813 pad 1.626: 1 -16.51,-3.81; 2 -13.97,-3.81; 3 -11.43,-3.81; 4 -8.89,-3.81; 5 -6.35,-3.81; 6 -3.81,-3.81; 7 -1.27,-3.81; 8 1.27,-3.81; 9 3.81,-3.81; 10 6.35,-3.81; 11 8.89,-3.81; 12 11.43,-3.81; 13 13.97,-3.81; 14 16.51,-3.81; 15 16.51,3.81; 16 13.97,3.81; 17 11.43,3.81; 18 8.89,3.81; 19 6.35,3.81; 20 3.81,3.81; 21 1.27,3.81; 22 -1.27,3.81; 23 -3.81,3.81; 24 -6.35,3.81; 25 -8.89,3.81; 26 -11.43,3.81; 27 -13.97,3.81; 28 -16.51,3.81
1X05 = drill 1.016 pad 1.88: 1 0,0; 2 2.54,0; 3 5.08,0; 4 7.62,0; 5 10.16,0
ESP-12 = smd 2 x 1.2: 1 -7.5,4.5; 2 -7.5,2.5; 3 -7.5,0.5; 4 -7.5,-1.5; 5 -7.5,-3.5; 6 -7.5,-5.5; 7 -7.5,-7.5; 8 -7.5,-9.5; 9 7.5,-9.5; 10 7.5,-7.5; 11 7.5,-5.5; 12 7.5,-3.5; 13 7.5,-1.5; 14 7.5,0.5; 15 7.5,2.5; 16 7.5,4.5
HC49US = drill 0.7 pad 1.651: 1 -2.54,0; 2 2.54,0

### Placement (x,y rotation side)
5V  5.08,25.4 180 top
C1  13.97,19.05 0 top
C2  29.21,12.7 0 top
C4  87.3,49.2 180 top
CN1  4.4,37.8 270 top
CON1  55.88,35.56 270 top
HM1  85.09,6.35 0 top
IC1  17.64,44.45 0 top
IC2  84.7,17.6 0 top
IC3  35.8,44.1 0 bottom
IC4  93.2,17.4 0 top
IC5  82.2,26.8 0 top
IC6  91.1,26.9 0 top
IC8  49.8,4.7 90 top
ICSP  17.78,11.43 0 top
J1  96.2,42.6 270 top
LED1  25.49,48.94 180 top
LED2  83.1,9 180 bottom
LOGO1  36.83,12.7 0 top
LS1  44.98,34.29 0 top
PYRO1  41.91,49.53 180 top
PYRO2  55.88,49.53 180 top
PYRO3  69.85,49.53 180 top
Q1  17.64,39.37 0 top
Q2  15.24,29.21 0 top
Q3  17.84,34.29 0 top
R1  71.12,12.7 0 top
R2  71.12,38.1 0 top
R4  71.12,43.18 0 top
R5  71.12,40.64 0 top
R6  71.12,33.02 0 top
R7  71.12,30.48 0 top
R8  71.12,15.24 0 top
R9  71.12,35.56 0 top
R10  71.12,27.94 0 top
R11  71.12,25.4 0 top
R15  71.1,7.6 180 top
RXLED  4.8,46 180 top
S2  33,39.6 0 top
SERVO1  7.62,21.59 180 top
SERVO2  7.62,17.78 180 top
SERVO3  7.62,13.97 180 top
TXLED  4.8,29.8 180 top
U1  41.91,21.59 0 top
UART  12.7,10.16 180 top
X1  88.4,33.8 0 bottom
Y1  32.74,31.15 180 top

### Tracks (layer width: path | path; a pad name or v marks a point on that pad's centre or on a via)
3.3V  (via drill 0.35)
  Top 0.152: v31.85,47.7 30.18,46.02 28.19,46.02 | 28.19,46.02 15.39,46.02 v10.21,40.84 | v8.69,16.76 6.25,14.33 6.25,13.26 v4.72,11.73 | v8.38,7.62 14.94,7.62 v17.37,5.18 | v45.26,1.98 v43.13,4.12 | 28.19,46.02 28.19,48.31 27.58,48.92 27.13,48.92 LED1.5 | IC6.6 92.66,26.67 92.3,26.67 91.99,26.36 90.35,26.36 90.04,26.67 89.61,26.67 IC6.3 89.46,26.67 89,26.67 88.54,27.13 88.54,28.04 88.93,28.43 | 88.93,28.43 89.31,28.8 89.15,28.8 v89,28.96 | J1.4 94.79,35.05 94.18,35.05 91.14,32 91.14,30.49 91.04,30.39 91.04,29.11 90.68,28.75 89.58,28.75 89.31,28.48 89.01,28.48 88.96,28.43 88.93,28.43 | 81.23,26.21 81.23,27.13 81.69,27.58 81.69,27.89 IC5.3 81.69,28.04 81.69,28.35 81.99,28.65 83.36,28.65 83.67,28.35 83.67,28.04 IC5.7 83.82,28.04 84.43,28.04 85.8,29.41 85.8,49.07 C4.2 | 81.23,26.21 81.23,25.76 IC5.14 81.2,25.2 82.14,24.17 82.14,23.27 82.15,23.27 82.15,23.22 82.5,22.86 82.73,22.86 82.73,21.9 81.81,20.98 80.93,20.98 80.8,20.84 80.77,20.82 80.77,20.12 80.92,19.96 81.69,19.96 IC2.2 | 81.23,26.21 82.45,26.21 82.6,26.06 82.6,25.76 IC5.11 | 84.58,5.94 84.58,5.33 84.73,5.18 85.04,5.18 HM1.6 85.19,5.03 85.8,5.64 87.02,5.64 HM1.2 | 84.58,5.94 85.04,6.4 HM1.8 | v81.99,5.94 84.58,5.94 | v96.01,23.16 96.01,19.36 IC4.8
  Bottom 0.152: 85.9,48.8 C4.2 | v31.85,47.7 39.32,47.7 40.08,46.94 40.08,43.43 38.86,42.22 38.86,41.91 IC3.3 | v10.21,40.84 10.21,18.29 v8.69,16.76 | v4.72,11.73 5.18,11.73 6.4,10.52 6.4,9.6 v8.38,7.62 | v17.37,5.18 18.75,3.81 42.82,3.81 v43.13,4.12 | v45.26,1.98 45.87,1.37 72.24,1.37 77.88,7.01 78.18,6.71 80.01,6.71 80.77,5.94 v81.99,5.94 84.58,5.94 89,10.36 89,21.95 89.92,22.86 | 85.95,48.77 C4.2 | C4.2 85.95,49.23 88.16,51.43 89.45,51.43 90.53,50.36 90.53,39.62 92.41,37.74 | X1.8 96.01,24.23 v96.01,23.16 93.88,23.16 93.57,22.86 89.92,22.86 | 92.41,37.74 94.79,35.36 94.94,35.36 95.86,34.44 X1.3 | 89.92,22.86 89,23.77 v89,28.96 89,34.34 92.4,37.74 92.41,37.74
3VCS1
  Top 0.152: J1.2 94.79,37.19 94.49,37.19 94.02,36.72 94.02,36.08 90.22,32.28 90.22,31.98 | IC2.5 81.84,17.98 83.67,17.98 85.19,19.51 85.19,19.79 85.19,20.06 84.83,20.42 84.82,20.42 84.54,20.7 84.54,20.84 86.72,23.01 86.72,28.04 86.72,29.01 88.95,31.25 89.86,31.25 90.22,31.6 90.22,31.98 | 90.22,31.55 90.22,31.98
3VCS2  (via drill 0.35)
  Top 0.152: v89.92,14.63 89.61,14.63 87.64,12.66 83.25,12.66 83.23,12.68 82.25,11.7 81.11,11.7 80.01,12.8 80.01,14.94 80.92,15.85 81.69,15.85 IC2.8 | v89.92,20.27 89.92,19.81 90.37,19.36 IC4.1
  Bottom 0.152: v89.92,20.27 v89.92,14.63
3VCS3  (via drill 0.35)
  Top 0.152: v83.06,17.37 83.06,15.85 82.6,15.39 81.84,15.39 IC2.9 | v83.97,24.69 v82.75,23.47
  Bottom 0.152: v83.97,24.69 83.97,30.79 83.67,31.09 83.06,31.09 82.14,30.18 82.14,27.58 80.92,26.36 X1.10 | v82.75,23.47 83.06,23.16 83.06,22.58 83.97,21.67 83.97,18.27 v83.07,17.37 v83.06,17.37
3VLED1B  (via drill 0.35)
  Top 0.152: v78.79,39.78 78.79,18.9 80.92,16.76 81.69,16.76 IC2.7 | v79.86,41.45 80.47,40.84 81.08,40.84 81.38,41.15 81.38,41.76 71.32,51.82 v26.36,51.82 | v27.28,50.9 27.28,50.14 27.13,49.99 LED1.6
  Bottom 0.152: v78.79,39.78 78.79,40.39 v79.86,41.45 | v27.28,50.9 v26.36,51.82
3VLED1G
  Top 0.152: IC2.6 81.69,17.37 80.92,17.37 79.1,19.2 79.1,39.22 79.4,39.53 79.4,40.08 78.18,41.3 78.18,43.13 73.15,48.16 60.5,48.16 57.15,51.51 26.98,51.51 25.91,50.44 25.91,48.46 26.36,48.01 26.98,48.01 LED1.4
3VMISO  (via drill 0.35)
  Top 0.152: v93.57,30.79 94.49,31.7 94.79,31.7 J1.7 | v84.58,19.81 84.58,19.36 83.82,18.59 81.84,18.59 IC2.4 | 88.24,21.34 v87.78,21.34 | 88.24,21.34 89.31,20.27 89.31,19.05 90.37,17.98 IC4.2 | v90.53,24.08 90.53,23.62 88.24,21.34
  Bottom 0.152: v93.57,30.79 94.64,29.72 94.64,29.57 95.1,29.11 | 95.1,29.11 95.86,28.35 X1.6 | v84.58,19.81 86.26,19.81 v87.78,21.34 | 95.1,29.11 91.14,25.15 91.14,24.69 v90.53,24.08
3VMOSI  (via drill 0.35)
  Top 0.152: J1.3 94.79,36.12 94.49,36.12 90.53,32.16 v90.53,30.94 89.08,30.94 87.02,28.88 87.02,28.43 87.33,28.12 v87.33,27.43 | IC2.3 81.84,19.36 82.6,19.36 82.7,19.45 82.7,19.52 82.73,19.55 82.73,21.03 83.95,22.25 84.38,22.25 84.42,22.29 84.89,22.29 v84.89,25.15 | v93.27,23.47 93.27,17.98 95.1,16.15 95.25,16.15 95.86,15.54 IC4.5
  Bottom 0.152: v90.53,30.94 90.53,30.57 89.61,29.66 89.61,23.62 90.07,23.16 92.81,23.16 93.12,23.47 | 93.12,23.47 95.86,26.21 X1.7 | v84.89,25.15 84.89,25.45 86.87,27.43 v87.33,27.43 | 93.12,23.47 v93.27,23.47
3VSCK  (via drill 0.35)
  Top 0.152: v93.57,33.53 94.03,33.98 94.79,33.98 J1.5 | v84.12,22.86 81.84,20.57 IC2.1 | v90.22,24.99 90.04,24.99 88.57,23.52 v88.57,22.89 | v92.51,24.23 93.42,24.23 93.88,23.77 93.88,18.59 95.56,16.92 95.86,16.92 IC4.6
  Bottom 0.152: v93.57,33.53 93.57,32.61 94.03,32.16 | 94.03,32.16 95.86,30.33 X1.5 | v88.57,22.89 84.16,22.89 v84.12,22.86 | 94.03,32.16 93.25,31.38 93.25,31.32 92.97,31.04 92.97,29.88 91.14,28.05 90.22,28.05 v90.22,24.99 89.92,24.69 89.92,23.77 90.22,23.47 90.83,23.47 91.59,24.23 v92.51,24.23
3VSCL
  Top 0.152: HM1.4 87.17,4.42 87.33,4.42 92.66,9.75 92.66,23.16 91.9,23.93 91.9,25.3 92.66,26.06 IC6.5 92.81,26.21 94.03,26.21 96.32,28.5 96.32,38.71 95.71,39.32 90.68,39.32 87.33,35.97 87.33,30.48 84.12,27.28 84.12,26.82 IC5.8
3VSDA  (via drill 0.35)
  Top 0.152: HM1.3 87.17,5.18 87.48,5.18 92.35,10.06 92.35,23.01 91.44,23.93 91.44,25.45 90.83,26.06 89.61,26.06 IC6.4 89.46,26.06 89.18,25.78 v87.4,25.78 | v86.11,25.76 83.82,25.76 IC5.9
  Bottom 0.152: v87.4,25.78 86.13,25.78 v86.11,25.76
5V  (via drill 0.35, 0.35 pad 0.4, 1, 1.5)
  Top 0.152: IC2.19 87.44,20.07 86.81,20.07 86.67,20.2 86.67,20.84 86.81,20.98 v86.81,21.79
  Top 0.2: CN1.VBUS 8.61,39.55 | 10.99,40 12,40
  Top 0.35: v78.37,11.94 78.37,15.88
  Top 1: 51.6,9 v51.7,9.1
  Bottom 0.152: 29.8,47.6 30.85,46.55 30.85,43.1 31.68,42.27 33.82,42.27 37.95,46.4 IC3.1
  Bottom 0.35: v47.6,10.5 50.3,10.5 v51.7,9.1 | v56.7,4.6 55.3,4.6 54.89,4.19 52.91,4.19 v51.9,5.2 | v45.8,6.4 47.2,6.4 v48.7,4.9 | v45,11.8 v47.9,11.8 | v78.37,11.94 77.5,11.07 75.27,11.07 72.98,8.78 v72.98,5.54 | v79.56,17.07 79.56,18.77 v80.05,19.26 | v81.93,21.96 83.36,20.53 v83.36,19.22 | v85.89,23.96 v87.74,23.96 87.74,25.12 88.1,25.49 88.1,26.07 88.06,26.12 v88.06,26.74 | v90.43,29.36 90.85,29.77 v91.99,29.77 | v92.64,28.68 91.19,27.23 v91.19,27.02
  Bottom 0.5: v45.6,10.2 v45.6,8.3
  Bottom 1: v2.5,19.7 6.3,19.7 v6.4,19.6 | 5V.1 SERVO1.2 | v12,41.1 12.1,41 v12.1,34.7 | v24.5,38.8 20.97,38.8 20.77,39.01 14.09,39.01 v12,41.1 | v12,44.4 v12,41.1 | v15.4,9.3 16.5,8.2 v16.6,8.2
  Bottom 1.5: v14.8,12.2 14.8,14 v12.6,16.2 v19.8,16.2 | v24.4,42.2 29.8,47.6 v29.8,47.8 | U1.7 40.64,15.24 v39.6,14.2
  pour Top: -5.08,58.42 -5.08,0 3.81,-8.89 146.13,-8.89 165.84,10.82 155.11,59.69 -3.81,59.69
BUZ
  Bottom 0.152: U1.26 30.48,25.3 30.79,25.3 32.16,23.93 33.53,23.93 34.29,24.69 34.29,24.84 34.14,24.99 34.14,25.76 34.29,25.91 34.29,26.21 34.9,26.82 40.23,26.82 40.39,26.98 40.84,26.98 41,26.82 44.5,26.82 50.9,33.22 50.9,36.88 49.99,37.8 49.07,37.8 48.01,36.73 48.01,34.44 48.16,34.29 LS1.+
CS1  (via drill 0.35)
  Top 0.152: 76.66,8.99 69.04,8.99 68.89,9.14 66.6,9.14 66.45,8.99 65.68,8.99 64.92,9.75 64.92,10.67 65.84,11.58 67.06,11.58 67.21,11.73 70.87,11.73 71.17,12.04 | 71.17,12.04 71.22,12.09 71.22,23.42 70.41,24.23 60.96,24.23 v60.5,24.69 | v73.3,44.04 73,44.04 72.85,44.2 71.48,44.2 71.02,43.74 71.02,42.37 70.26,41.6 67.97,41.6 v67.82,41.45 | v58.52,32.16 58.52,25.45 U1.15 | v81.68,13.27 82.15,13.27 83.06,14.17 83.06,14.33 86.56,17.83 87.63,17.83 IC2.16 | v79.71,11.31 71.9,11.31 71.17,12.04
  Bottom 0.152: v60.5,24.69 59.13,24.69 U1.15 | 77.27,44.04 77.27,44.5 77.11,44.65 73.91,44.65 v73.3,44.04 | v67.82,41.45 67.82,40.84 66.14,39.17 65.53,39.17 v58.52,32.16 | v81.68,13.27 v81.67,13.27 v79.71,11.31
CS2  (via drill 0.35)
  Top 0.152: v68.58,8.53 68.73,8.69 76.81,8.69 78.18,10.06 v79.7,10.06 | v74.22,14.17 76.66,14.17 77.27,14.78 77.27,23.32 76.35,24.23 71.63,24.23 71.02,24.84 71.02,26.21 70.87,26.36 66.6,26.36 66.45,26.52 65.53,26.52 v63.86,24.84 | 81.97,12.32 v81.69,12.32 82.93,13.57 84.07,13.57 86.36,15.85 86.58,15.85 87.63,15.85 IC2.13
  Bottom 0.152: v74.22,14.17 v68.58,8.53 | v63.86,24.84 61.57,24.84 60.81,24.08 57.15,24.08 55.93,25.3 U1.16 | v81.69,12.32 79.7,10.34 v79.7,10.06
CS3  (via drill 0.35)
  Top 0.152: v85.8,14.17 86.87,15.24 87.63,15.24 IC2.12 | v76.66,10.06 76.05,9.45 66.14,9.45 v65.84,9.75 | v43.13,13.11 v44.04,12.19
  Bottom 0.152: v85.8,14.17 85.8,7.62 85.19,7.01 78.33,7.01 75.89,9.45 75.44,9.45 75.13,9.75 75.13,10.36 75.44,10.67 76.05,10.67 v76.66,10.06 | v65.84,9.75 64.31,9.75 61.57,12.5 44.35,12.5 v44.04,12.19 | v43.13,13.11 40.54,13.11 40.23,12.8 37.95,12.8 33.07,17.68 U1.4
GND  (via drill 0.35, 0.5, 0.5 pad 0.4, 0.7, 1, 1.5)
  Top 0.152: 9.42,36.27 CN1.GND 8.14,36.52 7.21,36.52 7.08,36.66 7.08,39.74 7.21,39.88 8.1,39.88 9.33,41.1 9.33,43.3 9.2,43.43 5.82,43.43 RXLED.2 | TXLED.2 3.25,26.11 5V.2 | 51.35,4.05 50.14,2.85 50.14,2.13 IC8.6 | 61.2,11.89 59.89,11.89 59.59,11.58 59.59,9.75 59.13,9.3 58.52,9.3 58.27,9.55 56.54,9.55 56.54,9.47 54.6,7.54 v54.6,4.9 | 39.47,5.18 47,5.18 | 49.38,7.32 IC8.16 | LED1.3 23.93,48.01 23.93,48.92 LED1.2 23.93,49.07 23.93,49.53 | 23.93,49.53 23.93,49.84 LED1.1 | 23.93,49.53 20.88,49.53 v20.4,49.6 | 81.99,6.86 81.38,6.25 81.38,5.64 82.6,4.42 85.04,4.42 HM1.5 | 85.34,6.86 81.99,6.86 | 85.34,6.86 85.65,6.55 85.65,6.4 | 85.65,6.4 85.65,6.1 85.19,5.64 HM1.7 | 85.65,6.4 87.02,6.4 HM1.1 87.17,6.4 90.03,9.26 90.53,9.75 90.53,15.39 IC4.4 90.37,15.39 89.76,15.39 89.15,14.78 87.78,14.78 IC2.11 87.34,14.68 85.96,13.29 v84.86,13.29 | v80.62,23.16 80.62,25.6 IC5.15 | 83.21,27.28 83.21,27.89 IC5.6 | 83.21,27.28 83.21,26.36 | 83.21,26.36 83.21,25.76 IC5.10 83.21,25.6 83.21,25.3 v82.6,24.69 | 83.21,27.28 82.45,27.28 82.3,27.43 82.3,27.89 IC5.4 | IC6.2 89.46,27.13 89,27.13 88.85,27.28 88.85,27.89 89.14,28.18 89.44,28.18 89.71,28.45 90.81,28.45 91.34,28.98 91.34,30.27 91.44,30.36 91.44,30.48 v91.75,30.79 93.88,32.92 94.79,32.92 J1.6 | 83.21,26.36 84.58,26.36 84.67,26.45 84.67,26.57 84.68,26.58 84.68,27.41 89.13,31.85 v89.61,31.85 | v68.1,16.82 66.89,15.62 66.46,15.62 66.24,15.4 66.24,15.08 66.46,14.86 67.07,14.86 v68.21,13.72 | 85.34,6.86 86.71,8.22 v86.71,9.25 | 81.84,6.86 81.99,6.86
  Top 0.2: 9.4,36.2 CN1.GND | v41.4,24 42,23.4 v42,22.6 | v61.6,14.2 61.4,14.2 v60.6,15 | v54.6,4.9 53.75,4.05 51.35,4.05 | v53.5,5.9 50.2,5.9 v50,5.7 | v47.4,4.4 47,4.8 47,5.18 47.71,5.9 48.67,5.9 49.32,6.54 49.32,7.25 IC8.16 49.6,7.53 v49.6,8.9 | v27.5,7.2 28.4,6.3 v28.4,5.2
  Top 0.35: v64.6,28.8 63.4,27.6 v61,27.6 | v60.6,18.2 60.6,19.2 v61,19.6 | v49.6,27.8 v49.6,26.2 | v43.2,10.2 v39.6,10.2 | v61.6,14.2 61.2,13.8 61.2,11.89 v61.2,9.2 62.8,9.2 v63.4,8.6 64.4,7.6 R15.2 | v11.8,14.6 v10,14.6 10,13.2 v9,12.2 | v9.6,23.6 v12.2,23.6 | v21.6,19 21.8,18.8 v21.8,17 | v41.3,8 41.6,7.7 v41.6,6.3 | v79.16,14.65 79.16,12.91 v79.26,12.81 80.77,11.3 82.42,11.3 82.47,11.36 v82.85,11.36 84.75,11.36 v84.81,11.42 | v79.72,21.71 80.24,21.71 81.3,22.77 v81.51,22.77 | v91.07,34.9 90.21,35.76 v90.21,36.61 | v75.11,5.57 75.54,6 76.72,6 77.49,6.76 84.22,6.76 v86.71,9.25 90.02,9.25 90.03,9.26 90.03,11 90.62,11.6 90.62,14.92 90.47,15.07 IC4.4
  Top 0.5: Q3.3 17.23,34.9 14.62,34.9 13.32,36.2 CN1.GND | v2.5,23.5 2.6,23.6 v6.6,23.6 | v62.8,20.9 61.9,21.8 v61.9,22.7 | v58.5,21.2 v58.5,23.2
  Top 0.7: v42.01,14.06 42.01,12.76 v41.44,12.19
  Top 1: R2.1 61.94,42.2 v61.8,42.2 | CON1.- 51.14,38.06 v50.8,38.4 49,40.2 v48.8,40.2 | v18.8,7.8 v18.8,5.2 | v30.8,4.8 v30.8,2 | v13.4,45.7 16.75,49.05 18.71,49.05 19.26,49.6 v20.4,49.6 | v21.2,27.4 22.6,28.8 22.98,28.8 24.2,30.02 v24.2,32.2 | v70.7,2.7 66.6,2.7 v64.3,5 | v34.24,7.47 34.68,7.03 v34.68,5.11
  Top 2: v32.6,15 34.8,12.8 v34.8,11 | SERVO3.3 SERVO2.3
  Bottom 0.152: CON1.- 55.93,38.1 55.96,38.1 | 27.66,47.57 29.24,49.15 30.36,49.15 31.15,48.36 31.15,45.7 IC3.4 | 88.85,49.07 C4.1 | v80.62,23.16 80.62,24.08 80.77,24.23 X1.9 80.92,24.23 82.14,24.23 v82.6,24.69 | v89.61,31.85 90.68,31.85 v91.75,30.79 | 84.86,10.18 84.73,10.06 LED2.1
  Bottom 0.35: 79.19,21.19 v79.72,21.71
  other vias: 43.4,36
  pour Bottom: -6.35,62.23 -6.35,0 5.08,-11.43 151.81,-11.43 225.47,62.23
LED1B  (via drill 0.35)
  Top 0.152: 65.99,17.83 v64.77,17.83 62.48,17.83 62.48,17.77 62.18,17.47 62.18,17.05 61.14,16 37.8,16 36.12,17.68 35.66,17.68 U1.5 | v64.92,11.58 64.92,13.26 v64.77,13.41 | v91.75,16.15 89.61,16.15 89.15,16.61 87.78,16.61 IC2.14 | v89.61,13.41 88.85,13.41 86.11,10.67 v65.84,10.67
  Bottom 0.152: v64.92,11.58 v65.84,10.67 | v64.77,17.83 v64.77,13.41 | v91.75,16.15 91.75,15.54 v89.61,13.41
LED1G  (via drill 0.35)
  Top 0.152: 66.14,22.86 61.57,18.29 | 61.57,18.29 59.59,16.31 39.78,16.31 38.41,17.68 38.1,17.68 U1.6 | 86.87,17.22 87.63,17.22 IC2.15 86.92,17.27 v83.82,14.17 | v68.28,10.06 v75.74,10.06 | v71.93,19.51 v71.93,17.68 | 61.57,18.29 v61.72,18.14
  Bottom 0.152: v83.82,14.17 83.82,10.82 83.52,10.52 83.52,8.38 82.45,7.32 78.49,7.32 v75.74,10.06 | v68.28,10.06 68.97,10.76 68.97,14.72 v71.93,17.68 | v71.93,19.51 63.86,19.51 62.48,18.14 v61.72,18.14
MISO  (via drill 0.35)
  Top 0.152: v44.04,23.32 48.46,23.32 50.44,25.3 50.75,25.3 U1.18 | v19.81,18.29 16.15,14.63 16.15,13.26 17.07,12.34 | 17.07,12.34 17.68,11.73 17.68,11.43 ICSP.1 | v8.99,9.14 9.45,9.14 9.6,8.99 13.72,8.99 17.07,12.34 | v57.45,3.96 v58.67,2.74 | v80.62,14.02 82.45,14.02 82.75,14.33 82.75,14.48 86.72,18.44 87.63,18.44 IC2.17
  Bottom 0.152: v44.04,23.32 43.59,23.32 41.15,20.88 24.6,20.88 22.01,18.29 v19.81,18.29 | v8.99,9.14 8.99,5.94 11.73,3.2 50.6,3.2 51.05,3.66 57.15,3.66 v57.45,3.96 | v58.67,2.74 65.23,2.74 74.09,11.61 76.68,11.61 76.81,11.73 76.96,11.73 79.25,14.02 v80.62,14.02
MOSI  (via drill 0.35)
  Top 0.152: v23.01,18.29 23.01,17.07 20.42,14.48 20.42,14.02 ICSP.4 | v77.57,42.82 77.57,35.36 76.5,34.29 v70.5,34.29 | v86.04,20.98 86.04,20.18 86.87,19.36 87.63,19.36 IC2.18 | v83.36,30.48 83.36,37.03 v78.79,41.6
  Bottom 0.152: v23.01,18.29 25.3,20.57 42.82,20.57 46.94,24.69 46.94,24.84 47.09,24.99 47.09,25.76 46.94,25.91 46.94,26.06 47.7,26.82 52.12,26.82 52.88,26.06 52.88,25.91 53.34,25.45 U1.17 53.34,25.3 56.36,22.27 59.46,22.27 61.11,23.93 66.45,23.93 70.5,27.98 v70.5,34.29 | v86.04,20.98 85.63,20.56 85.5,20.56 85.5,22.01 85.33,22.18 85.31,22.16 83.91,22.16 83.36,22.71 v83.36,30.48 | v77.57,42.82 v78.79,41.6
N$1  (via drill 0.35)
  Top 0.152: v33.83,28.35 34.59,28.35 36.88,26.06 36.88,25.91 36.73,25.76 36.73,25.15 36.88,24.99 36.88,24.69 37.64,23.93 39.32,23.93 44.35,18.9 44.81,18.9 45.26,18.44 45.26,18.29 45.72,17.83 U1.9
  Bottom 0.152: v33.83,28.35 31.09,31.09 30.33,31.09 Y1.2
N$2
  Top 0.152: U1.10 48.16,17.83 48.16,18.14 41.91,24.38 41.91,24.84 41.76,24.99 41.76,25.76 41.91,25.91 41.91,28.96 40.08,30.79 36.42,30.79 36.12,31.09 35.36,31.09 Y1.1
N$3  (via drill 0.35)
  Top 0.152: v47.09,16.92 46.94,17.07 46.94,17.22 47.09,17.37 47.09,18.14 46.94,18.29 46.94,18.59 46.33,19.2 44.5,19.2 38.41,25.3 38.1,25.3 U1.23
  Bottom 0.152: 19.81,23.01 34.14,23.01 35.05,23.93 36.42,23.93 37.8,25.3 38.1,25.3 U1.23 | 76.81,21.79 75.59,21.79 75.44,21.64 74.98,21.64 R1.1 65.99,12.8 51.21,12.8 v47.09,16.92 | 76.96,21.64 76.81,21.79 | 76.81,21.79 78.18,23.16 78.18,35.36 76.2,37.34 76.2,37.95 R2.2
N$4  (via drill 0.35)
  Top 0.152: v55.02,40.23 54.25,41 43.13,41 39.93,44.2 15.09,44.2 13.87,42.98 13.87,40.23 11.43,37.8 8.51,37.8 CN1.D+ | v63.55,45.72 65.99,43.28 R4.1
  Bottom 0.152: v55.02,40.23 58.06,40.23 v63.55,45.72
N$5
  Top 0.152: 48.36,6.25 48.77,6.65 48.77,7.32 IC8.17 | 39.01,6.25 37.95,5.18 37.95,2.74 37.19,1.98 35.05,1.98 31.24,5.79 29.5,5.79 29.41,5.79 | 1.39,9.59 1.98,8.99 2.74,8.99 8.08,3.66 29.16,3.66 | 1.37,30.33 3.2,32.16 3.81,32.16 3.96,32.31 3.96,34.9 3.66,35.2 3.66,40.84 3.96,41.15 3.96,43.28 2.74,44.5 2.44,44.5 2.13,44.81 2.13,47.24 2.29,47.4 4.88,47.4 6.25,46.02 RXLED.1
  Top 0.2: 39.01,6.25 39.95,6.25 40.69,5.51 46.83,5.51 47.57,6.25 48.36,6.25 | 29.5,5.79 29.5,4 29.16,3.66 | 1.37,30.33 1.15,30.1 1.15,9.82 1.39,9.59
N$6  (via drill 0.35)
  Top 0.152: v59.59,15.09 59.59,12.95 58.98,12.34 58.98,10.06 v58.83,9.91 | v59.89,17.53 59.89,31.85 55.32,36.42 50.9,36.42 46.63,40.69 37.8,40.69 37.64,40.84 30.18,40.84 | 30.18,40.84 29.87,40.84 29.26,41.45 S2.1 | 30.18,40.84 30.18,39.78 30.02,39.62 29.87,39.62 29.26,39.01 S2.3 | v55.63,9.91 49.58,9.91 48.36,8.69 47.55,8.69 47.09,8.23 47.09,7.47 IC8.20
  Bottom 0.152: v59.59,15.09 59.59,17.22 v59.89,17.53 | v58.83,9.91 v55.63,9.91
N$7  (via drill 0.35)
  Top 0.152: v58.67,15.09 59.28,14.48 59.28,13.11 58.67,12.5 58.06,12.5 56.24,10.67 56.24,9.6 54.23,7.6 | v57.3,16.92 57.3,32.16 57.61,32.46 57.61,33.68 55.93,35.36 48.77,35.36 48.46,35.66 45.26,35.66 43.89,37.03 29.87,37.03 29.26,37.64 S2.4 29.11,37.8 28.8,37.8 28.19,38.41 28.19,39.47 28.35,39.62 28.5,39.62 29.11,40.23 S2.2 | 48.92,2.94 48.92,2.13 IC8.4
  Top 0.2: 48.92,2.94 50.38,4.41 53.2,4.41 54.23,5.44 54.23,7.6
  Bottom 0.152: v58.67,15.09 58.67,15.54 v57.3,16.92
N$8
  Top 0.152: 48.31,4.27 48.31,2.13 IC8.3 | 50.75,6.71 50.75,7.32 IC8.14 50.9,7.47 51.36,7.47 IC8.13
  Top 0.2: 50.75,6.71 | 50.75,6.71 50.44,6.4 49.67,6.4 48.81,5.54 47.86,5.54 47.51,5.19 47.51,5.18 48.31,4.38 48.31,4.27
N$10
  Top 0.152: CN1.D- 8.51,38.56 11.43,38.56 13.56,40.69 13.56,43.13 16.15,45.72 30.79,45.72 36.27,51.21 57,51.21 64.62,43.59 64.62,42.22 66.14,40.69 R5.1
N$11  (via drill 0.35)
  Top 0.152: v57.61,7.01 52.73,2.13 IC8.10 | v58.06,8.53 v59.44,7.16 | v11.43,20.88 6.4,25.91 6.4,29.72 TXLED.1 | v28.8,7.16 30.18,8.54 38.4,8.54 v39.78,7.16
  Bottom 0.152: v57.61,7.01 59.28,7.01 v59.44,7.16 | v39.78,7.16 45.98,7.16 47.05,8.23 53.85,8.23 53.95,8.13 57.66,8.13 v58.06,8.53 | v28.8,7.16 23.32,12.65 17.22,12.65 15.39,10.82 14.17,10.82 11.12,13.87 11.12,20.57 v11.43,20.88
N$12
  Bottom 0.152: LED2.4 81.69,8.08 82.14,8.08 83.21,9.14 83.21,10.64 83.52,10.95 83.52,13.62 83.21,13.93 83.21,15.09 88.7,20.57 88.7,22.07 89.44,22.82 89.44,22.91 88.7,23.65 88.7,26.98 81.38,34.29 80.92,34.29 X1.14
N$13
  Bottom 0.152: LED2.5 81.53,9.14 79.7,9.14 79.1,9.75 79.1,11.58 81.23,13.72 81.23,21.18 79.25,23.16 79.25,30.63 80.77,32.16 X1.13
N$14  (via drill 0.35)
  Top 0.152: v91.14,21.64 91.14,24.99 90.53,25.6 89.76,25.6 89.31,25.15 87.25,25.15 87.02,24.92 87.02,22.89 86.94,22.81 86.94,22.78 85.5,21.34 85.47,21.34 84.9,20.77 84.95,20.72 84.96,20.72 85.5,20.19 85.5,17.68 82.6,14.78 81.84,14.78 IC2.10 | v89.61,12.5 88.39,12.5 83.52,7.62 76.2,7.62 R15.1
  Bottom 0.152: v91.14,21.64 91.14,17.68 92.35,16.46 92.35,15.24 v89.61,12.5
N$15  (via drill 1)
  Top 1: Q1.2 18.77,35.7 18.77,35.48 19.85,34.4 v22.4,34.4
  Bottom 1: v22.4,34.4 38.4,34.4 41.91,37.91 PYRO1.1
N$16
  Top 2: R7.1 63.5,30.48 58.38,35.6 58.38,39.1 53.03,44.45 41.99,44.45 PYRO1.2
N$17  (via drill 1)
  Top 1: v25,27.6 26.8,29.4 v39.6,29.4
  Bottom 1: Q2.2 16.37,25.54 16.37,25.32 17.19,24.49 21.89,24.49 v25,27.6 | v39.6,29.4 51.15,40.95 51.15,42.48 55.88,47.22 PYRO2.1
N$18
  Top 2: R9.1 65.24,35.56 51.27,49.53 PYRO2.2
N$19  (via drill 1)
  Top 1: Q3.2 18.97,30.62 18.97,30.4 19.79,29.57 20.97,29.57 21.59,30.2 v22.4,30.2 | v49.4,36.4 46.6,36.4 v45,38
  Bottom 1: v22.4,30.2 27.16,30.2 29.59,32.63 31.71,32.63 36.34,28 44.12,28 49.77,33.65 49.77,34.93 49.4,35.3 v49.4,36.4 | PYRO3.1 67.21,49.53 65.54,51.2 54.59,51.2 54.21,50.82 54.21,47.21 v45,38
N$20
  Bottom 2: R11.1 65.49,25.95 65.22,25.95 60.61,30.56 54.84,30.56 52.8,32.6 52.8,41.8 57.12,41.8 PYRO3.2
N$21
  Bottom 0.152: LED2.6 81.69,10.06 81.69,11.12 82.3,11.73 82.3,20.57 79.55,23.32 79.55,28.96 80.77,30.18 X1.12
PYRO1
  Bottom 0.152: Q1.1 15.09,36.73 15.09,35.36 14.94,35.2 14.94,33.98 11.28,30.33 11.28,21.95 14.33,18.9 14.33,18.44 15.09,17.68 23.32,17.68 24.99,19.36 56.54,19.36 58.06,17.83 58.37,17.83 U1.14 58.52,17.83 59.28,17.83 60.34,18.89 62.67,18.89 65.18,21.39 67.06,21.39 69.59,23.93 75.29,23.93 75.44,23.77 75.59,23.77 75.89,24.08 76.35,24.08 76.5,23.93 76.96,23.93 77.88,24.84 77.88,31.24 76.2,32.92 R6.2
PYRO2  (via drill 0.35)
  Top 0.152: v46.48,15.09 v49.68,11.89 | v44.5,17.07 44.5,17.37 44.35,17.53 44.35,18.44 39.17,23.62 37.49,23.62 35.66,25.45 U1.24 | v70.2,14 69.83,13.63 69.4,13.63 69.27,13.49 69.27,13.32 69.03,13.08 67.21,13.08 66.53,13.77 65.4,13.77 65.01,14.15 63.35,14.15
  Top 0.2: v62,11.2 62.2,11.4 62.2,12.4 63,13.2 v63,13.8 63.35,14.15 | R8.2 75.24,16.2 v73.4,16.2
  Bottom 0.152: Q2.1 12.8,26.67 13.26,26.21 13.26,26.06 14.02,25.3 14.02,25.15 15.85,23.32 33.68,23.32 35.66,25.3 U1.24 | v44.5,17.07 v46.48,15.09
  Bottom 0.2: v49.68,11.89 59.92,11.89 59.94,11.91 61.49,11.91 62,11.4 v62,11.2 | v70.2,14 72.4,16.2 v73.4,16.2
PYRO3  (via drill 0.35)
  Top 0.152: v77.27,26.98 76.81,27.43 75.59,27.43 74.98,26.82 73.15,26.82 73,26.67 66.75,26.67 66.6,26.82 65.38,26.82 65.23,26.67 v60.5,26.67 | v35.36,23.32 33.38,25.3 33.07,25.3 U1.25
  Bottom 0.152: Q3.1 15.39,31.7 16.61,30.48 16.61,30.33 18.14,28.8 24.54,28.8 24.69,28.96 29.11,28.96 32.61,25.45 32.92,25.45 U1.25 | v77.27,26.98 76.96,27.28 76.81,27.28 76.2,27.89 R10.2 | v60.5,26.67 58.98,26.67 58.52,27.13 45.41,27.13 44.5,26.21 44.5,25.91 44.35,25.76 44.35,24.99 44.5,24.84 44.5,24.69 43.13,23.32 v35.36,23.32
RST
  Top 0.152: ICSP.5 22.86,11.73 24.99,13.87 24.99,17.37 U1.1
  Bottom 0.152: ICSP.5 22.55,11.43 21.03,9.91 17.37,9.91 17.22,10.06 12.8,10.06 UART.1 12.65,10.21 12.65,10.67 10.82,12.5 10.82,45.26 11.89,46.33 11.89,47.24
RXE  (via drill 0.35)
  Top 0.152: v42.98,40.08 41.91,39.01 36.88,39.01 S2.6
  Bottom 0.152: v42.98,40.08 42.98,43.89 51.66,52.58 71.93,52.58 88.54,35.97 88.54,35.36 88.24,35.05 87.63,35.05 86.41,36.27 80.92,36.27 X1.15
RXM  (via drill 0.35)
  Top 0.152: U1.2 27.89,17.83 27.58,17.83 25.61,19.8 19.51,19.8 18.29,18.58 v18.29,18.29 18.44,18.14 10.52,10.21 10.21,10.21 UART.2 | v32.92,41.45 36.73,41.45 S2.8 | v18.29,29.57 16.31,27.58 16.31,23.32 v14.63,21.64
  Bottom 0.152: v32.92,41.45 26.98,35.51 21.95,35.51 18.9,32.46 18.9,30.18 v18.29,29.57 | v14.63,21.64 14.63,18.59 15.24,17.98 17.98,17.98 v18.29,18.29
SCK  (via drill 0.35)
  Top 0.152: v33.22,19.96 31.7,18.44 31.7,18.29 31.85,18.14 31.85,17.37 31.7,17.22 31.7,17.07 | 31.7,17.07 28.8,14.17 27.28,14.17 24.38,11.28 24.38,10.82 23.47,9.91 22.1,9.91 20.57,11.43 ICSP.3 | v60.2,11.28 60.2,6.4 76.56,6.4 77.32,7.16 83.52,7.16 87.94,11.58 v89.61,11.58 | v43.89,11.28 38.25,11.28 32.92,16.61 32.16,16.61 31.7,17.07 | v91.75,19.96 91.75,17.83 91.29,17.37 89.61,17.37 89,17.98 89,19.81 88.39,20.42 87.78,20.42 IC2.20
  Bottom 0.152: v33.22,19.96 43.28,19.96 48.16,24.84 48.16,25.3 U1.19 | v43.89,11.28 43.99,11.18 60.1,11.18 v60.2,11.28 | v91.75,19.96 91.75,17.53 92.66,16.61 92.66,14.63 v89.61,11.58
SCL  (via drill 0.35)
  Top 0.152: v36.88,2.59 34.88,2.59 31.32,6.15 29.4,6.15 29.31,6.15 | U1.28 25.3,25.3 23.47,25.3 16.15,17.98 11.73,17.98 11.12,18.59 11.12,19.81 8.08,22.86 7.16,22.86 6.4,22.1 6.4,21.18 3.81,18.59 3.81,9.75 9.6,3.96 28.96,3.96 29.1,4.1 | v94.36,27.45 94.22,27.58 92.81,27.58 IC6.8 | v93.88,25.6 96.62,28.35 96.62,38.86 95.86,39.62 90.53,39.62 86.41,35.51 v86.41,35.36
  Top 0.2: 29.4,6.15 29.39,6.14 29.3,6.14 29.09,5.93 29.09,5.66 29.1,5.64 29.1,4.1
  Bottom 0.152: v36.88,2.59 50.44,2.59 51.21,3.35 65.34,3.35 75.85,13.87 76.77,13.87 77.57,14.67 77.57,15.59 77.86,15.87 77.88,15.85 78.79,16.76 78.79,34.14 80.01,35.36 v86.41,35.36 | v94.36,27.45 94.36,26.08 v93.88,25.6
SDA  (via drill 0.35)
  Top 0.152: v26.67,31.24 26.67,30.79 23.93,28.04 23.93,27.28 24.69,26.52 26.82,26.52 U1.27 | v87.94,35.66 91.29,39.01 95.56,39.01 96.01,38.56 96.01,29.11 95.86,28.96 94.8,28.96 94.8,28.62 94.24,28.06 92.05,28.06 91.72,27.74 89.61,27.74 IC6.1
  Bottom 0.152: v26.67,31.24 28.8,33.38 38.56,33.38 52.27,47.09 52.27,49.99 54.25,51.97 70.26,51.97 77.57,44.65 77.57,43.74 77.88,43.43 79.7,43.43 87.48,35.66 v87.94,35.66
SERVO1  (via drill 0.35)
  Top 0.152: v41.76,18.75 39.93,20.57 19.2,20.57 16.31,17.68 11.28,17.68 7.62,21.34 SERVO1.1
  Bottom 0.152: v41.76,18.75 42.06,19.05 49.23,19.05 50.44,17.83 50.75,17.83 U1.11
SERVO2  (via drill 0.35)
  Top 0.152: v47.7,14.78 v50.14,14.78
  Bottom 0.152: v50.14,14.78 53.03,17.68 53.34,17.68 U1.12 | v47.7,14.78 47.09,14.78 45.11,12.8 43.77,12.8 37.3,6.33 14.39,6.33 11.28,9.45 11.28,9.6 11.43,9.75 11.43,10.67 11.28,10.82 11.28,10.97 11.43,11.12 11.43,11.43 9.14,13.72 9.14,15.24 7.77,16.61 7.77,17.53 7.62,17.68 SERVO2.1
SERVO3  (via drill 0.35)
  Top 0.152: v51.97,13.41 50.29,11.73 50.29,11.58 48.01,9.3 16.62,9.3 15.86,8.53 7.01,8.53 6.25,9.3 6.25,10.97 7.77,12.5 7.77,13.72 7.62,13.87 SERVO3.1
  Bottom 0.152: v51.97,13.41 55.78,17.22 55.78,17.68 U1.13
TXE  (via drill 0.35)
  Top 0.152: v43.89,40.08 41.6,37.8 36.88,37.8 S2.5 | v78.18,44.04 v80.77,41.45
  Bottom 0.152: v43.89,40.08 43.89,44.35 51.82,52.27 70.41,52.27 78.18,44.5 v78.18,44.04 | v80.77,41.45 80.77,38.41 X1.16
TXM  (via drill 0.35)
  Top 0.152: U1.3 30.48,17.83 30.02,18.29 30.02,18.44 28.36,20.11 19.19,20.11 10.82,11.73 9.6,11.73 8.08,10.21 7.62,10.21 UART.3 | v30.79,40.23 36.73,40.23 S2.7
  Bottom 0.152: v30.79,40.23 24.08,40.23 18.29,46.02 14.94,46.02 12.5,48.46 11.43,48.46 1.37,38.41 1.37,16.92 3.81,14.48 3.81,13.56 7.16,10.21 7.62,10.21 UART.3
USBD+  (via drill 0.35)
  Top 0.152: v54.1,8.84 52.73,7.47 IC8.11 | v59.59,6.1 v56.84,8.84 | v78.18,17.68 v78.18,39.01
  Bottom 0.152: 76.2,43.28 R4.2 76.2,42.01 76.5,41.71 76.64,41.71 77.27,41.08 77.27,39.93 | v56.84,8.84 v54.1,8.84 | v59.59,6.1 67.51,6.1 75.59,14.17 76.64,14.17 77.27,14.8 77.27,15.68 77.04,15.91 77.04,16.56 77.56,17.08 | 77.27,39.93 77.27,39.9 | 77.58,21.36 77.58,17.1 77.56,17.08 | v78.18,39.01 77.27,39.93 | v78.18,17.68 77.57,17.07 77.56,17.08
USBD-  (via drill 0.35)
  Top 0.152: v53.19,9.3 52.12,8.23 52.12,7.47 IC8.12
  Bottom 0.152: 76.2,40.69 R5.2 76.2,40.54 76.2,39.62 78.49,37.34 78.49,22.71 77.42,21.64 77.35,21.6 | v53.19,9.3 53.65,9.3 54.86,10.52 62.18,10.52 62.48,10.82 62.79,10.82 64.92,8.69 64.92,7.16 65.68,6.4 66.45,6.4 67.97,7.92 67.97,8.84 75.74,16.61 76.66,16.61 77.27,17.23 77.27,21.52 77.35,21.6 | 77.39,21.6 77.35,21.6
VIN  (via drill 0.35)
  Top 0.152: C1.+ 14.55,19.05 14.55,19.85 14.9,20.2 15.7,20.2 23.46,27.96 | 27.08,33.48 26.77,33.17 26.21,32.61 | v77.57,13.26 77.57,24.08 76.66,24.99 76.66,25.6 76.35,25.91 75.59,25.91 75.13,26.36 v74.98,26.21
  Top 0.2: 26.21,32.61 26.04,32.44 26.04,30.64 23.46,28.06 23.46,27.96
  Top 1: 17.96,39.6 17.83,39.73 17.05,39.73 16.23,40.56 16.23,40.78 IC1.1 | 27.2,33.36 27.93,32.63 35.89,32.63 36.12,32.4 55.22,32.4 CON1.+
  Top 1.27: CON1.+ 55.58,33.36 | 27.2,33.36 27.08,33.48 20.96,39.6 17.96,39.6
  Bottom 0.152: v77.57,13.26 77.57,12.95 77.42,12.8 76.2,12.8 R1.2 | v74.98,26.21 75.05,26.28
  Bottom 2: CON1.+ 64.05,41.23 64.05,44.01 65.22,45.17 66.86,45.17 68.03,44.01 68.03,43.45 74.79,36.69 | 74.79,36.69 75.92,35.56 R9.2 | 74.79,36.69 74.79,34.43 74.21,33.84 74.21,32.2 | 74.21,32.2 75.38,31.03 75.65,31.03 R7.2 | R11.2 75.65,25.95 75.38,25.95 75.05,26.28 74.21,27.11 74.21,32.2

### Text on the board
tNames: TVCFC rev1.5 / Brian Wong, 2023
bNames: Megadingus TVC Flight Controller! / Rev 1.5 | Brian Wong, 2023